# Altium project Mach_doan.PrjPcb
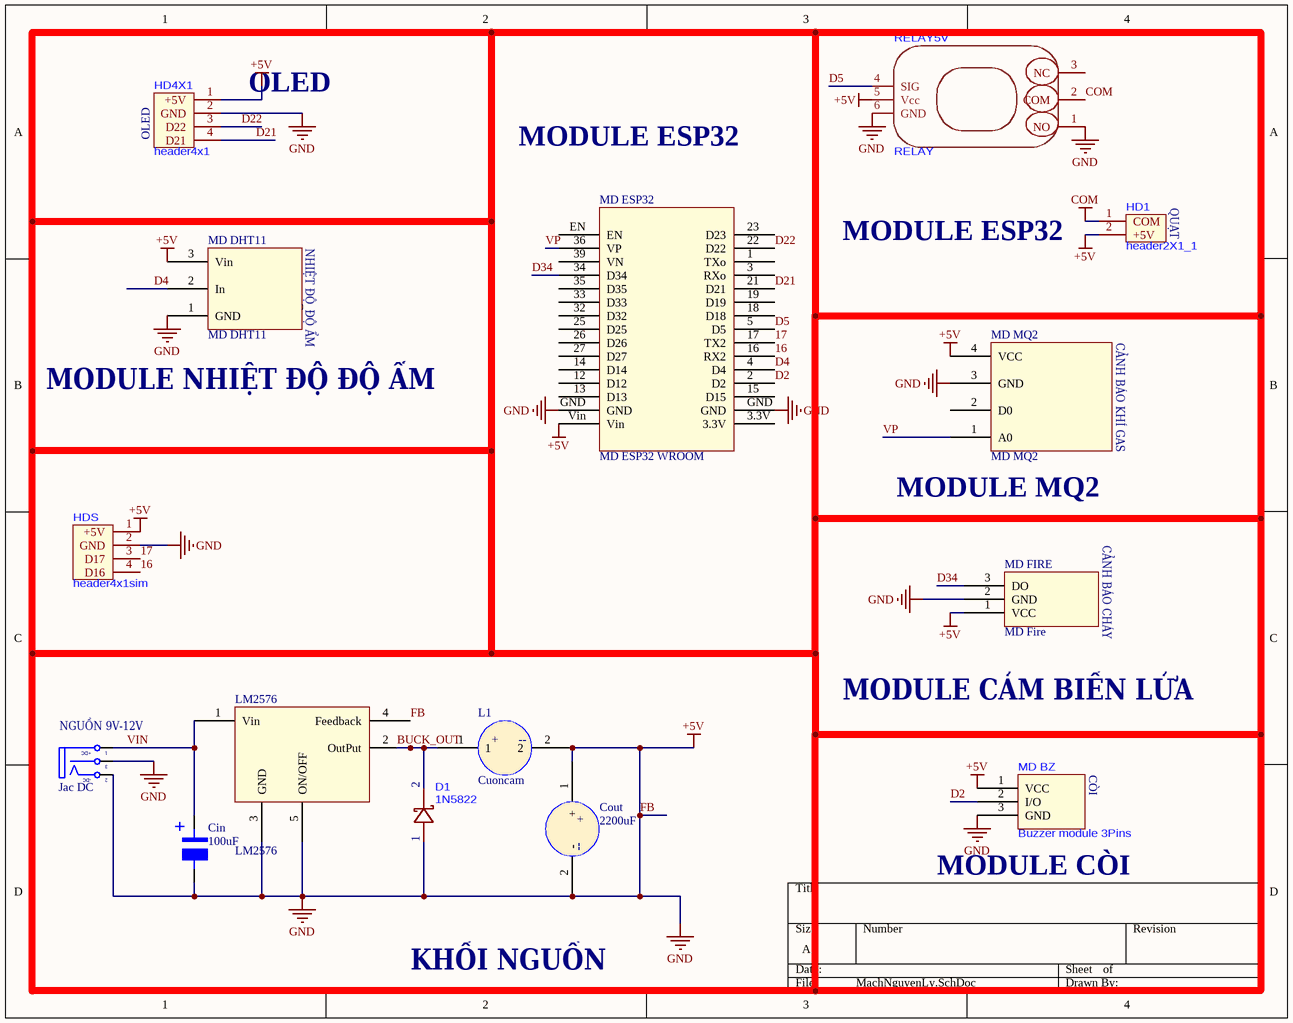
[diagram p0: MachNguyenLy.SchDoc]
1 sheet, 15 parts. Net scope: global (net labels, ports and power ports of the same name join across sheets).
Board file: MachPCB.PcbDoc

## Sheet MachNguyenLy.SchDoc
size A; SheetNumber: 1; SheetTotal: 1

### Parts
Cin  100uF  [Cap100uFx50V]
Cout  2200uF  [Cout]
D1  1N5822  [DO-201AD_BD5.3-L8.4-P12.50-D1.4-FD - duplicate]
HD1  header2X1_1  [HEADER2X1]
HD4X1  header4x1  [HEADER4X1]
HDS  header4x1sim  [HEADER4X1]
L1  Cuoncam  [Cuoncam]
LM2576  LM2576  [LM2576]
MD_BZ  Buzzer module 3Pins  [BUZZER MODULE]
MD_DHT11  MD DHT11  [MD DHT11]
MD_ESP32  MD ESP32 WROOM  [MD ESP32-WROOM]
MD_FIRE  MD Fire  [MD Fire]
MD_MQ2  MD MQ2  [MD MQ2]
NGUỒN_9V-12V  Jac DC  [DC-IN]
RELAY5V  RELAY  [Relay]

### Nets
COM: HD1.1(COM) RELAY5V.2(COM)
FB: Cin.2 Cout.1(+) Cout.2(-) D1.1(A) HD1.2(+5V) HD4X1.1(+5V) HD4X1.2(GND) HDS.1(+5V) HDS.2(GND) L1.2 LM2576.3(GND) LM2576.4(Feedback) LM2576.5(ON/OFF) MD_BZ.1(VCC) MD_BZ.3(GND) MD_DHT11.1(GND) MD_DHT11.3(Vin) MD_ESP32.GND MD_ESP32.Vin MD_FIRE.1(VCC) MD_FIRE.2(GND) MD_MQ2.3(GND) MD_MQ2.4(VCC) NGUỒN_9V-12V.2(TN) NGUỒN_9V-12V.3(S) RELAY5V.1(NO) RELAY5V.5(Vcc) RELAY5V.6(GND)  [also labelled +5V, GND]
16: HDS.4(D16) MD_ESP32.16(RX2)
17: HDS.3(D17) MD_ESP32.17(TX2)
BUCK_OUT: D1.2(K) L1.1 LM2576.2(OutPut)
D2: MD_BZ.2(I/O) MD_ESP32.2(D2)
D4: MD_DHT11.2(In) MD_ESP32.4(D4)
D5: MD_ESP32.5(D5) RELAY5V.4(SIG)
D21: HD4X1.4(D21) MD_ESP32.21(D21)
D22: HD4X1.3(D22) MD_ESP32.22(D22)
D34: MD_ESP32.34(D34) MD_FIRE.3(DO)
VIN: Cin.1 LM2576.1(Vin) NGUỒN_9V-12V.1(T)
VP: MD_ESP32.36(VP) MD_MQ2.1(A0)

Not connected (* = marked no-connect by the designer): MD_ESP32 1(TXo) 3(RXo) 3.3V 12(D12) 13(D13) 14(D14) 15(D15) 18(D18) 19(D19) 23(D23) 25(D25) 26(D26) 27(D27) 32(D32) 33(D33) 35(D35) 39(VN) EN; MD_MQ2 2(D0); RELAY5V 3(NC)

### Notes on the sheet
- OLED
- (near HD4X1) OLED
- MODULE ESP32
- (near HD1) QUẠT
- NHIỆT ĐỘ_ĐỘ ẨM
- CẢNH BÁO KHÍ GAS
- (near MD_DHT11) MODULE NHIỆT ĐỘ ĐỘ ẨM
- (near MD_MQ2) MODULE MQ2
- CẢNH BÁO CHÁY
- MODULE CẢM BIẾN LỬA
- (near L1) +
- (near L1) --
- CÒI
- (near Cout) +
- (near Cout) --
- (near MD_BZ) MODULE CÒI
- KHỐI NGUỒN
- (in symbol Cap100uF 50V) +
- (in symbol DCIN) +DC; -DC

### Library data of the parts
Cin = Cap100uF 50V: 220uF: 220uF
Cout = Cout
D1 = 1N5822_C211612
NGUỒN_9V-12V = DCIN: Jac DC input; Value: Jac DC